# EAGLE design led (EAGLE 9.2.1)

## Sheet 1 of 2
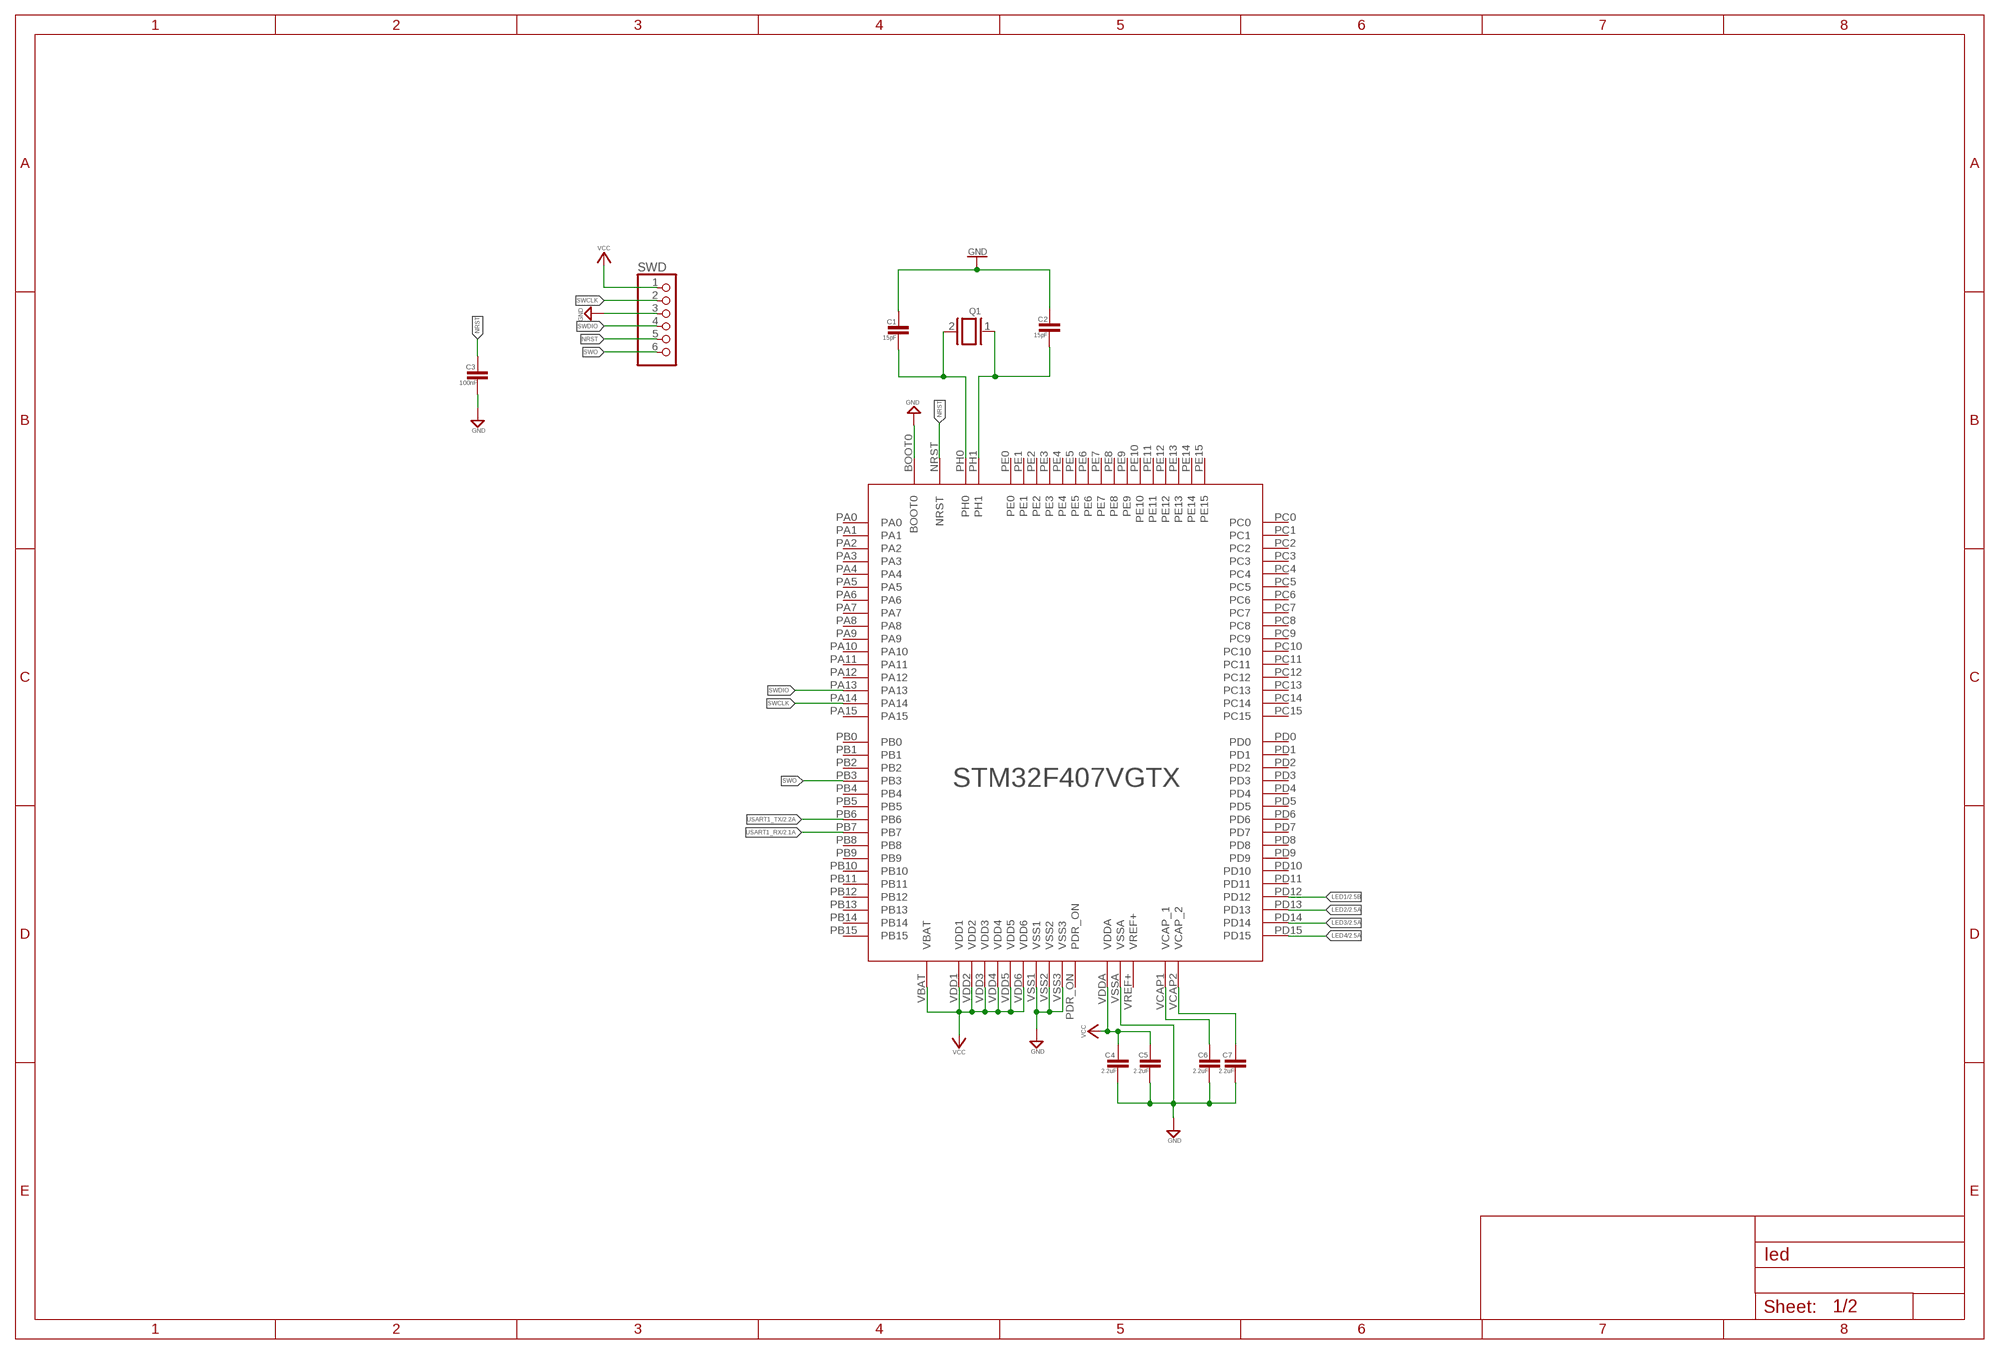
[diagram p0: schematic, sheet 1]

### Parts
C1  15pF  C-EUC0603  [C0603]
C2  15pF  C-EUC0603  [C0603]
C3  100nF  C-EUC0603  [C0603]
C4  2.2uF  C-EUC0603  [C0603]
C5  2.2uF  C-EUC0603  [C0603]
C6  2.2uF  C-EUC0603  [C0603]
C7  2.2uF  C-EUC0603  [C0603]
IC1  STM32F407VGTx  STM32F4V_100PIN_GENERIC  [LQFP100]
Q1  XTAL/S  [QS]
SWD  PINHD-1X6CB  [1X06-CLEANBIG]

### Nets
GND: C1.1 C2.1 C3.2 C4.2 C5.2 C6.2 C7.2 IC1.BOOT0 IC1.VSS1 IC1.VSS2 IC1.VSS3 IC1.VSSA SWD.3 ; also sheet 2
LED1: IC1.PD12 ; also sheet 2
LED2: IC1.PD13 ; also sheet 2
LED3: IC1.PD14 ; also sheet 2
LED4: IC1.PD15 ; also sheet 2
N$1: C2.2 IC1.PH1 Q1.1
N$2: C1.2 IC1.PH0 Q1.2
N$3: C6.1 IC1.VCAP1(VCAP_1)
N$4: C7.1 IC1.VCAP2(VCAP_2)
NRST: C3.1 IC1.NRST SWD.5
SWCLK: IC1.PA14 SWD.2
SWDIO: IC1.PA13 SWD.4
SWO: IC1.PB3 SWD.6
USART1_RX: IC1.PB7 ; also sheet 2
USART1_TX: IC1.PB6 ; also sheet 2
VCC: C4.1 C5.1 IC1.VBAT IC1.VDD1 IC1.VDD2 IC1.VDD3 IC1.VDD4 IC1.VDD5 IC1.VDD6 IC1.VDDA SWD.1 ; also sheet 2
Unconnected: IC1.PA0 IC1.PA1 IC1.PA2 IC1.PA3 IC1.PA4 IC1.PA5 IC1.PA6 IC1.PA7 IC1.PA8 IC1.PA9 IC1.PA10 IC1.PA11 IC1.PA12 IC1.PA15 IC1.PB0 IC1.PB1 IC1.PB2 IC1.PB4 IC1.PB5 IC1.PB8 IC1.PB9 IC1.PB10 IC1.PB11 IC1.PB12 IC1.PB13 IC1.PB14 IC1.PB15 IC1.PC0 IC1.PC1 IC1.PC2 IC1.PC3 IC1.PC4 IC1.PC5 IC1.PC6 IC1.PC7 IC1.PC8 IC1.PC9 IC1.PC10 IC1.PC11 IC1.PC12 IC1.PC13 IC1.PC14 IC1.PC15 IC1.PD0 IC1.PD1 IC1.PD2 IC1.PD3 IC1.PD4 IC1.PD5 IC1.PD6 IC1.PD7 IC1.PD8 IC1.PD9 IC1.PD10 IC1.PD11 IC1.PDR_ON IC1.PE0 IC1.PE1 IC1.PE2 IC1.PE3 IC1.PE4 IC1.PE5 IC1.PE6 IC1.PE7 IC1.PE8 IC1.PE9 IC1.PE10 IC1.PE11 IC1.PE12 IC1.PE13 IC1.PE14 IC1.PE15 IC1.VREF+

## Sheet 2 of 2
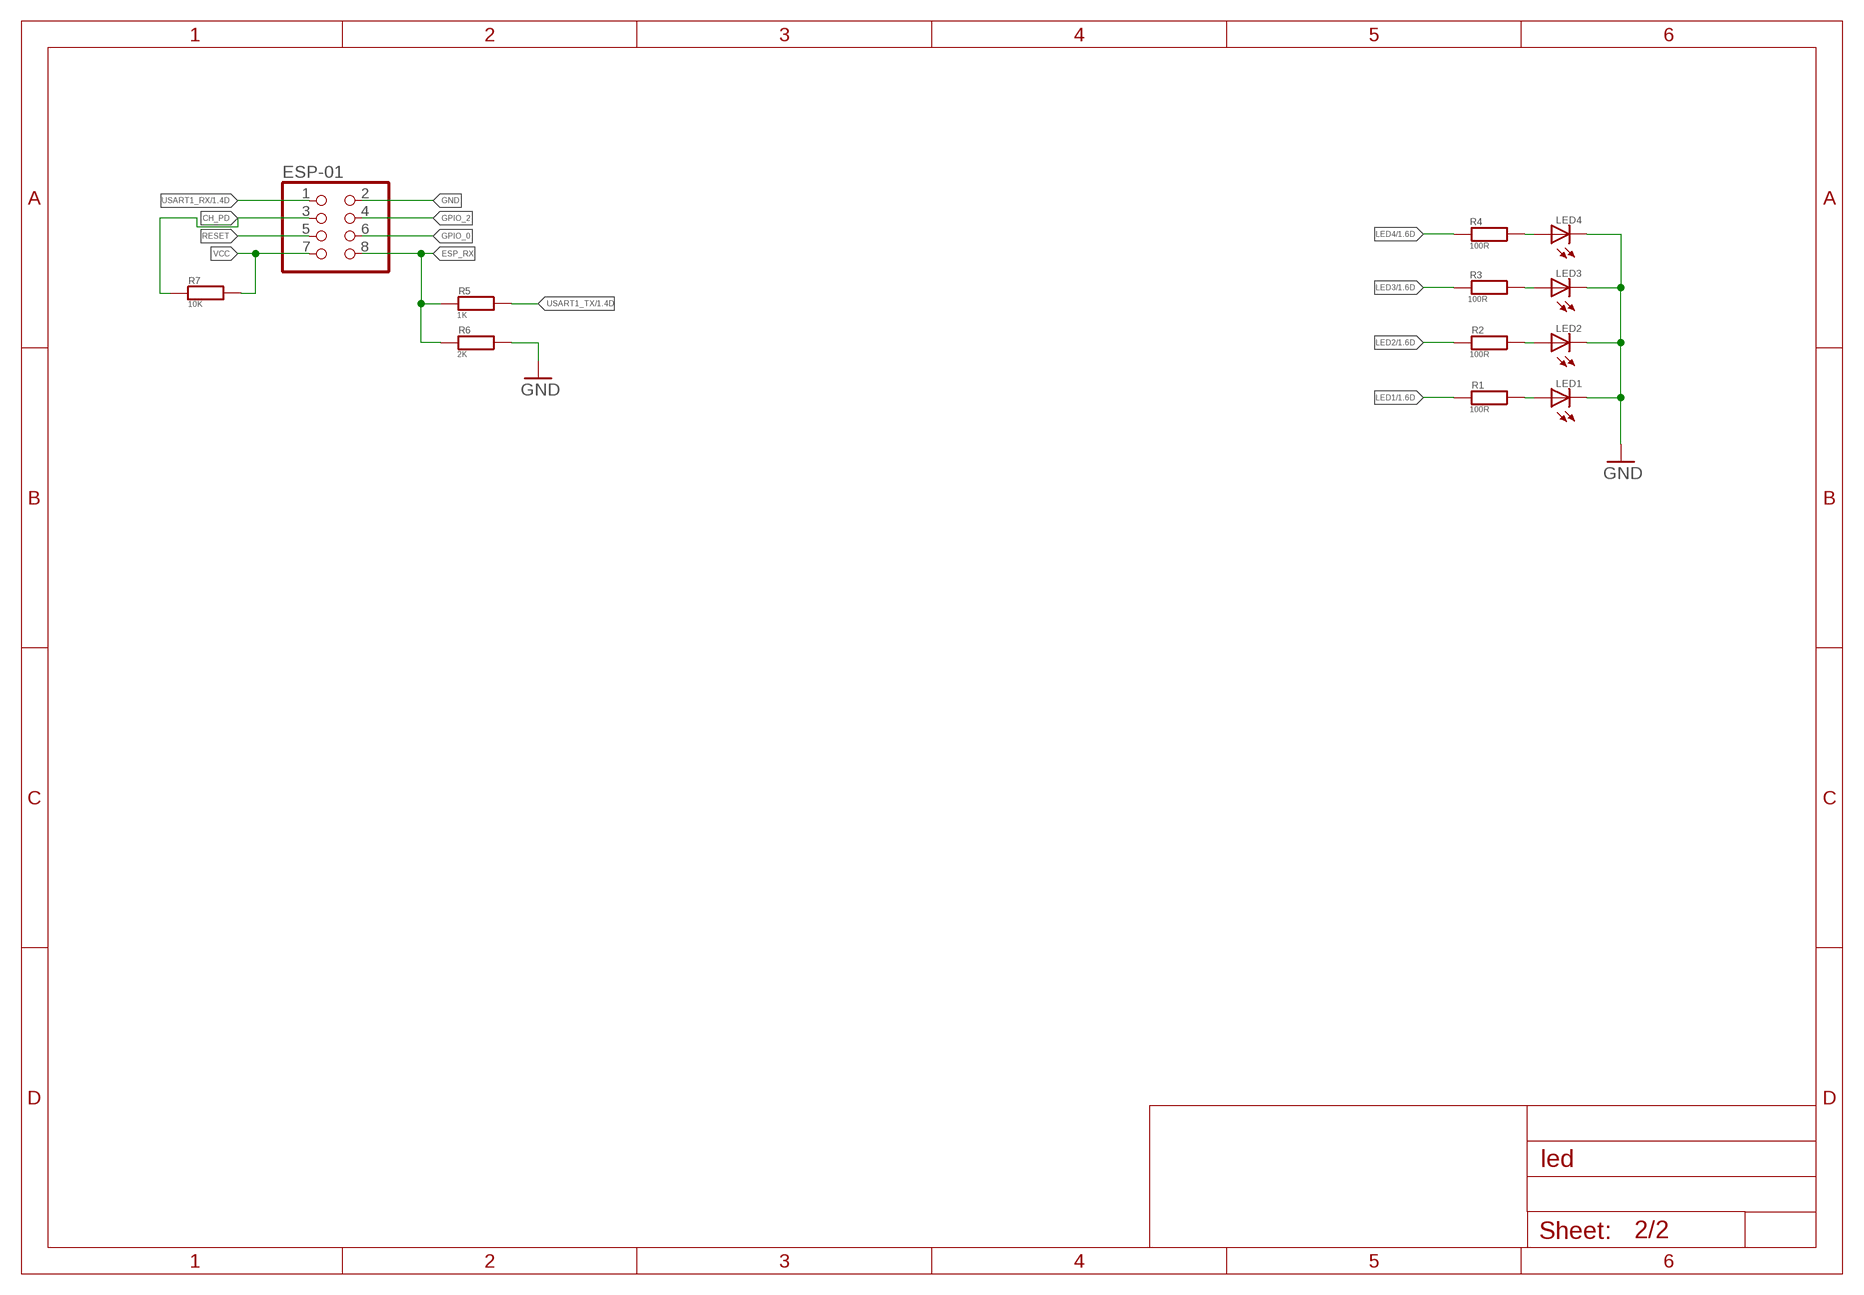
[diagram p1: schematic, sheet 2]

### Parts
ESP-01  PINHD-2X4  [2X04]
LED1  LEDCHIPLED_1206  [CHIPLED_1206]
LED2  LEDCHIPLED_1206  [CHIPLED_1206]
LED3  LEDCHIPLED_1206  [CHIPLED_1206]
LED4  LEDCHIPLED_1206  [CHIPLED_1206]
R1  100R  R-EU_R0603  [R0603]
R2  100R  R-EU_R0603  [R0603]
R3  100R  R-EU_R0603  [R0603]
R4  100R  R-EU_R0603  [R0603]
R5  1K  R-EU_R0603  [R0603]
R6  2K  R-EU_R0603  [R0603]
R7  10K  R-EU_R0603  [R0603]

### Nets
CH_PD: ESP-01.3 R7.1
ESP_RX: ESP-01.8 R5.2 R6.2
GND: ESP-01.2 LED1.C LED2.C LED3.C LED4.C R6.1 ; also sheet 1
GPIO_0: ESP-01.6
GPIO_2: ESP-01.4
LED1: R1.2 ; also sheet 1
LED2: R2.2 ; also sheet 1
LED3: R3.2 ; also sheet 1
LED4: R4.2 ; also sheet 1
N$5: LED1.A R1.1
N$6: LED2.A R2.1
N$7: LED3.A R3.1
N$9: LED4.A R4.1
RESET: ESP-01.5
USART1_RX: ESP-01.1 ; also sheet 1
USART1_TX: R5.1 ; also sheet 1
VCC: ESP-01.7 R7.2 ; also sheet 1

## Library data of the parts
C1-C7 = rcl:C-EU: CAPACITOR, European symbol; SPICEPREFIX: C
ESP-01 = adafruit:PINHD-2X4: PIN HEADER
IC1 = stm32f4:STM32F4V_100PIN_GENERIC; STM32F407VGTX: STM32F407VGTx
LED1-LED4 = led:LED: LED OSRAM: - CHIPLED LG R971, LG N971, LY N971, LG Q971, LY Q971, LO R971, LY R971 LH N974, LH R974 LS Q976, LO Q976, LY Q976 LO Q996 - Hyper CHIPLED LW Q18S LB Q993, LB Q99A, LB R99A - SideLED LS A670, LO A670, LY A670, LG A670, LP A670 LB A673, LV A673, LT A673, LW A673 LH A674 LY A675 LS A676, LA A676, LO A676, LY A676, LW A676 LS A679, LY A679, LG A679 - Hyper Micro SIDELED® LS Y876, LA Y876, LO Y876, LY Y876 LT Y87S - SmartLED LW L88C, LW L88S LB L89C, LB L89S, LG L890 LS L89K, LO L89K, LY L89K LS L896, LA L896, LO L896, LY L896 - TOPLED LS T670, LO T670, LY T670, LG T670, LP T670 LSG T670, LSP T670, LSY T670, LOP T670, LYG T670 LG T671, LOG T671, LSG T671 LB T673, LV T673, LT T673, LW T673 LH T674 LS T676, LA T676, LO T676, LY T676, LB T676, LH T676, LSB T676, LW T676 LB T67C, LV T67C, LT T67C, LS T67K, LO T67K, LY T67K, LW E67C LS E67B, LA E67B, LO E67B, LY E67B, LB E67C, LV E67C, LT E67C LW T67C LS T679, LY T679, LG T679 LS T770, LO T770, LY T770, LG T770, LP T770 LB T773, LV T773, LT T773, LW T773 LH T774 LS E675, LA E675, LY E675, LS T675 LS T776, LA T776, LO T776, LY T776, LB T776 LHGB T686 LT T68C, LB T68C - Hyper Mini TOPLED® LB M676 - Mini TOPLED Santana® LG M470 LS M47K, LO M47K, LY M47K Source: http://www.osram.convergy.de LUXEON: - LUMILED® LXK2-PW12-R00, LXK2-PW12-S00, LXK2-PW14-U00, LXK2-PW14-V00 LXK2-PM12-R00, LXK2-PM12-S00, LXK2-PM14-U00 LXK2-PE12-Q00, LXK2-PE12-R00, LXK2-PE12-S00, LXK2-PE14-T00, LXK2-PE14-U00 LXK2-PB12-K00, LXK2-PB12-L00, LXK2-PB12-M00, LXK2-PB14-N00, LXK2-PB14-P00, LXK2-PB14-Q00 LXK2-PR12-L00, LXK2-PR12-M00, LXK2-PR14-Q00, LXK2-PR14-R00 LXK2-PD12-Q00, LXK2-PD12-R00, LXK2-PD12-S00 LXK2-PH12-R00, LXK2-PH12-S00 LXK2-PL12-P00, LXK2-PL12-Q00, LXK2-PL12-R00 Source: www.luxeon.com KINGBRIGHT: KA-3528ASYC Source: www.kingbright.com
Q1 = special:XTAL/S: CRYSTAL
R1-R7 = rcl:R-EU_: RESISTOR, European symbol; SPICEPREFIX: R
SWD = adafruit:PINHD-1X6: PIN HEADER

## Board
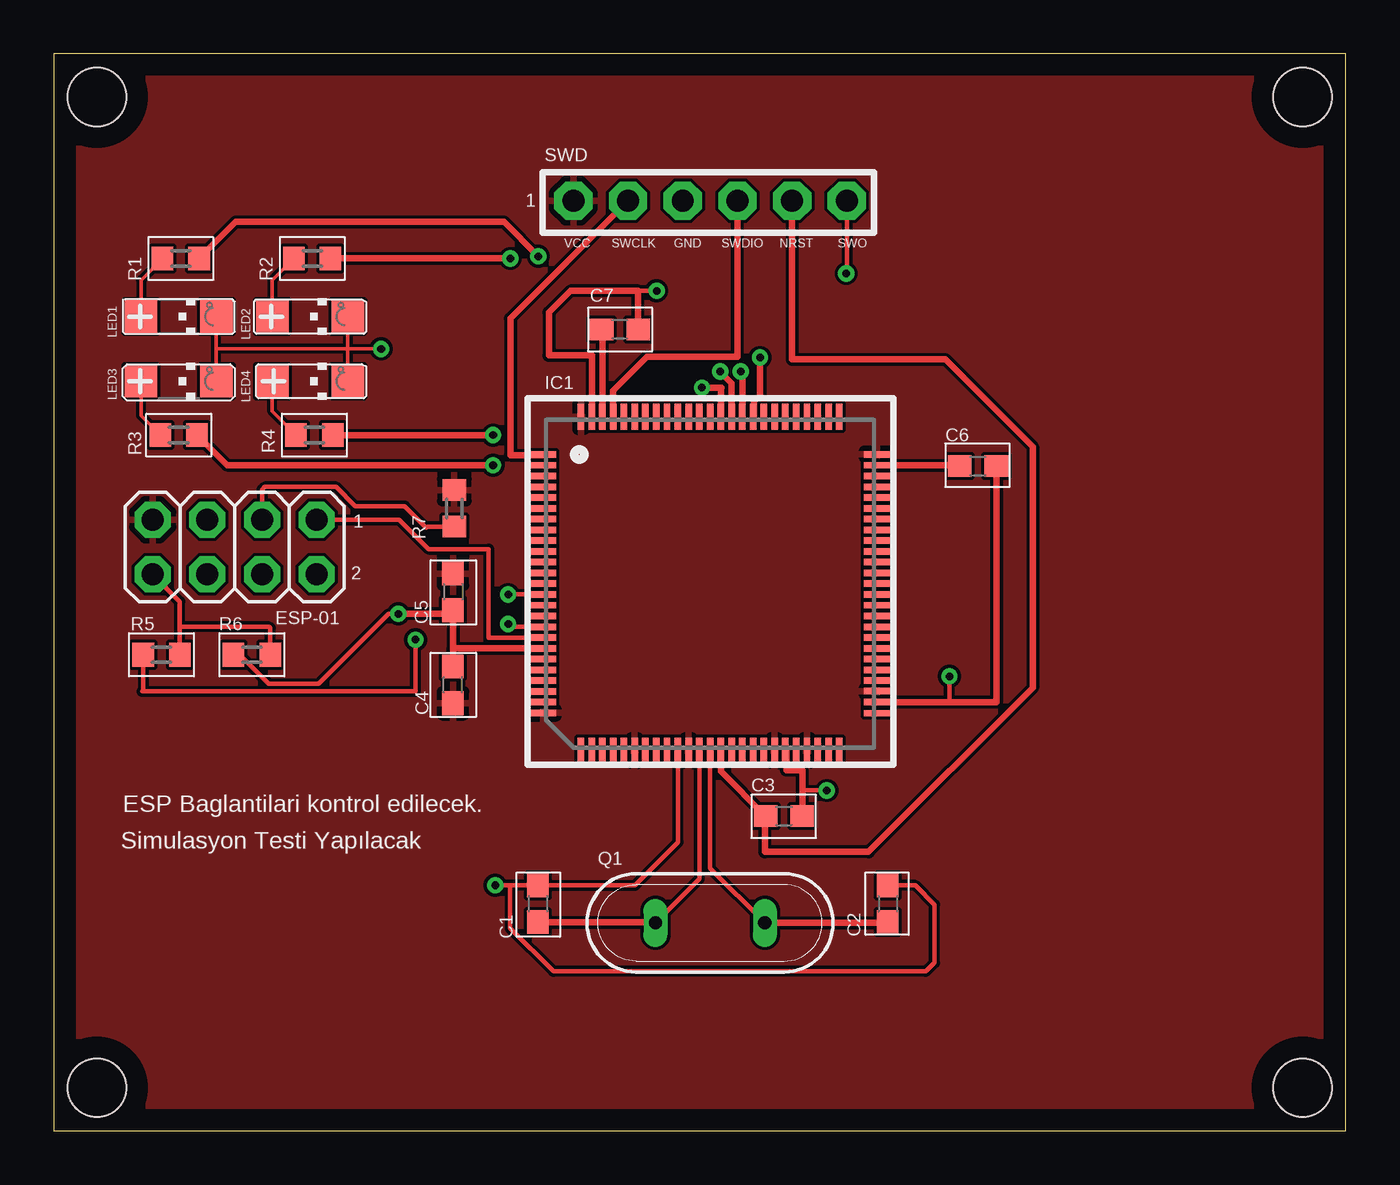
[diagram p2: board, top side]
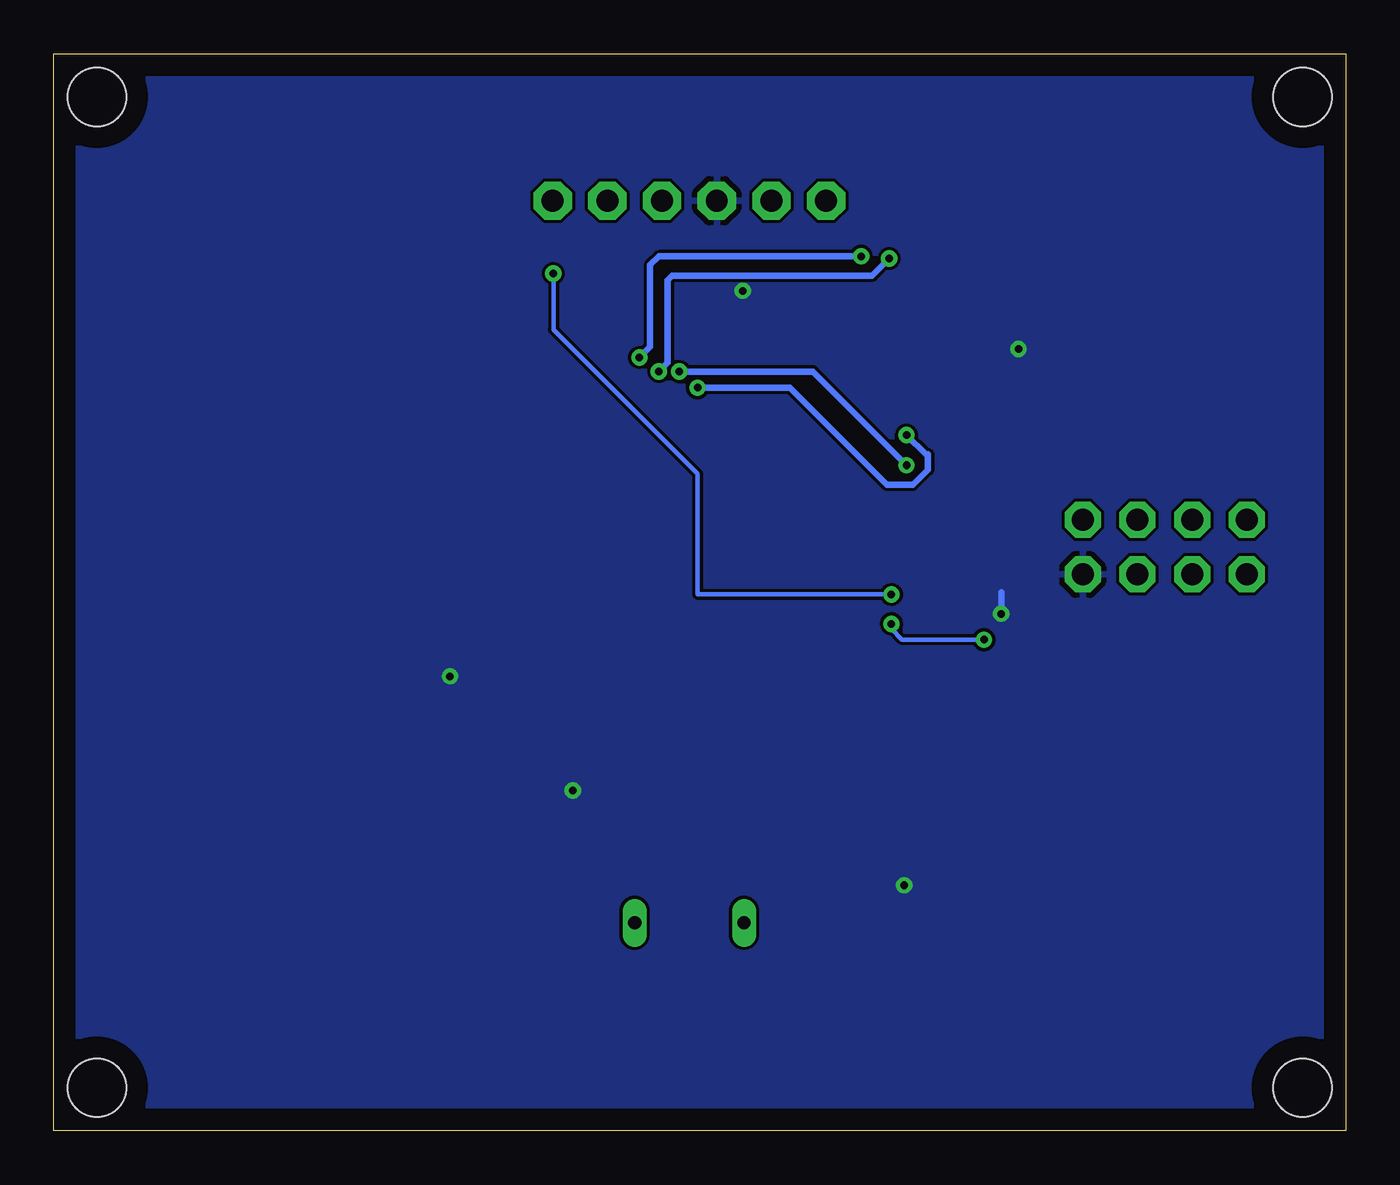
[diagram p3: board, bottom side, seen from below]

Size 60 x 50 mm. Coordinates in mm from the lower left corner, seen from the top.
Outline: 0,0 60,0 60,50 0,50 0,0
Copper layers (1*16): Top 0.035mm / dielectric 1.5mm / Bottom 0.035mm
Design rules "default": minimum track width 6mil, minimum drill 0.35mm, track to track 6mil, track to pad 6mil, pad to pad 6mil, via to via 6mil, smd to smd 6mil, copper to edge 40mil, drill to drill 6mil, minimum pad ring 10mil, minimum via ring 8mil, stop-mask expansion 4mil, vias tented up to drill 0mil, thermal gap 10mil
Holes 2.7 mm at 2,48 58,48 2,2 58,2

### Footprints (pad centres in the part's own frame; a part is rotated, then mirrored left to right if it is on the bottom)
C0603 = smd 1.1 x 1: 1 -0.85,0; 2 0.85,0
2X04 = drill 1.016 pad 1.676 octagon: 1 -3.81,-1.27; 2 -3.81,1.27; 3 -1.27,-1.27; 4 -1.27,1.27; 5 1.27,-1.27; 6 1.27,1.27; 7 3.81,-1.27; 8 3.81,1.27
LQFP100 = smd 1.2 x 0.3: BOOT0 -7.75,-3; PA3 7.75,-6.016; PA4 7.75,-4.5; PA5 7.75,-4; PA6 7.75,-3.5; PA7 7.75,-3; PA14 -7.75,6; PA15 -7.75,5.5; PB0 7.75,-1.5; PB1 7.75,-1; PB2 7.75,-0.5; PB3 -7.75,-0.5; PB4 -7.75,-1; PB5 -7.75,-1.5; PB6 -7.75,-2; PB7 -7.75,-2.5; PB8 -7.75,-3.5; PB9 -7.75,-4; PB10 7.75,4.5; PB11 7.75,5; PC4 7.75,-2.5; PC5 7.75,-2; PC10 -7.75,5; PC11 -7.75,4.5; PC12 -7.75,4; PD0 -7.75,3.5; PD1 -7.75,3; PD2 -7.75,2.5; PD3 -7.75,2; PD4 -7.75,1.5; PD5 -7.75,1; PD6 -7.75,0.5; PD7 -7.75,0; PDR_ON -7.75,-5.5; PE0 -7.75,-4.5; PE1 -7.75,-5; PE7 7.75,0; PE8 7.75,0.5; PE9 7.75,1; PE10 7.75,1.5; PE11 7.75,2; PE12 7.75,2.5; PE13 7.75,3; PE14 7.75,3.5; PE15 7.75,4; VCAP1 7.75,5.5; VDD3 7.75,-4.984; VDD4 7.75,6; VDD6 -7.75,-6; VSS2 7.75,-5.5 | smd 0.3 x 1.2: NRST 0.5,-7.75; PA0 5,-7.75; PA1 5.5,-7.75; PA2 6,-7.75; PA8 -2,7.75; PA9 -2.5,7.75; PA10 -3,7.75; PA11 -3.5,7.75; PA12 -4,7.75; PA13 -4.5,7.75; PB12 6,7.75; PB13 5.5,7.75; PB14 5,7.75; PB15 4.5,7.75; PC0 1,-7.75; PC1 1.5,-7.75; PC2 2,-7.75; PC3 2.5,-7.75; PC6 0,7.75; PC7 -0.5,7.75; PC8 -1,7.75; PC9 -1.5,7.75; PC13 -3,-7.75; PC14 -2.5,-7.75; PC15 -2,-7.75; PD8 4,7.75; PD9 3.5,7.75; PD10 3,7.75; PD11 2.5,7.75; PD12 2,7.75; PD13 1.5,7.75; PD14 1,7.75; PD15 0.5,7.75; PE2 -6,-7.75; PE3 -5.5,-7.75; PE4 -5,-7.75; PE5 -4.5,-7.75; PE6 -4,-7.75; PH0 -0.5,-7.75; PH1 0,-7.75; VBAT -3.5,-7.75; VCAP2 -5,7.75; VDD1 -1,-7.75; VDD2 3,-7.75; VDD5 -6,7.75; VDDA 4.5,-7.75; VREF+ 4,-7.75; VSS1 -1.5,-7.75; VSS3 -5.5,7.75; VSSA 3.5,-7.75
CHIPLED_1206 = smd 1.5 x 1.5: A 0,-1.75; C 0,1.75
QS = drill 0.61 long: 1 -2.54,0; 2 2.54,0
R0603 = smd 1 x 1.1: 1 -0.85,0; 2 0.85,0
1X06-CLEANBIG = drill 1.016 pad 1.778 octagon: 1 -6.35,0; 2 -3.81,0; 3 -1.27,0; 4 1.27,0; 5 3.81,0; 6 6.35,0

### Placement (x,y rotation side)
C1  22.48,10.54 270 top
C2  38.73,10.54 270 top
C3  33.91,14.61 0 top
C4  18.54,20.7 90 top
C5  18.54,25.02 270 top
C6  42.93,30.86 0 top
C7  26.29,37.21 0 top
ESP-01  8.4,27.1 180 top
IC1  30.48,25.4 0 top
LED1  5.8,37.8 270 top
LED2  11.9,37.8 270 top
LED3  5.8,34.8 270 top
LED4  11.9,34.8 270 top
Q1  30.48,9.65 180 top
R1  5.9,40.5 0 top
R2  12,40.5 0 top
R3  5.8,32.3 0 top
R4  12.1,32.3 0 top
R5  5,22.1 0 top
R6  9.2,22.1 0 top
R7  18.6,28.9 90 top
SWD  30.48,43.18 0 top

### Tracks (layer width: path | path; a pad name or v marks a point on that pad's centre or on a via)
CH_PD
  Top 0.203: R7.1 17.35,28.05 17.3,28 16.3,29 14,29 13.1,29.9 9.8,29.9 9.67,29.77 ESP-01.3
ESP_RX
  Top 0.203: R5.2 5.85,23.4 | 5.85,23.4 5.85,24.57 ESP-01.8 | R6.2 10.05,23.35 10,23.4 5.85,23.4
GND  (via drill 0.35)
  Top 0.152: LED3.C 7.55,36.3 | 7.55,36.3 LED1.C | LED2.C 13.65,36.3 | 13.65,36.3 LED4.C | 13.65,36.3 7.55,36.3 | 13.65,36.3 v15.2,36.3
  Top 0.203: R6.1 8.64,22.1 9.98,20.76 12.3,20.76 15.54,24 v16,24 | 41.6,19.9 v41.6,21.1 | 34.76,15.8 v35.9,15.8 | 21.2,11.39 C1.1 26.99,11.39 29,13.4 28.98,13.42 IC1.VSS1 | 21.2,11.39 v20.51,11.39 v20.5,11.4 | 21.2,11.39 21.2,9.4 23.2,7.4 40.5,7.4 40.9,7.8 40.9,10.5 40.01,11.39 C2.1 | 27.14,39 v28,39
  Top 0.305: IC1.BOOT0 18.54,22.4 C4.2 C5.2 18.54,24 v16,24 | C6.2 43.78,19.9 41.6,19.9 IC1.VSS2 | C3.2 34.76,15.8 34.76,16.75 34.02,16.75 34.02,17.65 IC1.VSSA | C7.2 27.14,39 24,39 23,38 23,36 25,36 25,33.15 IC1.VSS3
  Bottom 0.305: v16,24 16,25
  pour Bottom: -0.64,50.55 61.98,50.55 61.98,0.25 59.31,-2.41 -0.76,-2.41 -1.65,-1.52 -2.54,-0.64 -2.54,50.42 -0.76,50.42
LED1  (via drill 0.35)
  Top 0.305: R1.2 8.45,42.2 20.9,42.2 v22.5,40.6 | IC1.PD12 32.52,33.2 32.52,33.88 32.8,34.15 v32.8,35.9
  Bottom 0.305: v22.5,40.6 31.9,40.6 32.3,40.2 32.3,36.4 v32.8,35.9
LED2  (via drill 0.35)
  Top 0.305: R2.2 v21.2,40.5 | v31.9,35.26 31.98,35.18 IC1.PD13
  Bottom 0.305: v21.2,40.5 22,39.7 31.3,39.7 31.5,39.5 31.5,35.66 v31.9,35.26
LED3  (via drill 0.35)
  Top 0.305: R3.2 8.05,30.9 v20.4,30.9 | v30.95,35.25 31.48,34.71 IC1.PD14
  Bottom 0.305: v20.4,30.9 24.75,35.25 v30.95,35.25
LED4  (via drill 0.35)
  Top 0.305: R4.2 v20.4,32.3 | v30.1,34.5 31,34.5 30.98,34.48 IC1.PD15
  Bottom 0.305: v20.4,32.3 19.5,31.4 19.4,31.4 19.4,30.7 20.1,30 21.3,30 25.8,34.5 v30.1,34.5
N$1
  Top 0.203: IC1.PH1 30.48,12.19 Q1.1
  Top 0.305: Q1.1 38.7,9.65 C2.2
N$2
  Top 0.203: Q1.2 29.98,11.69 IC1.PH0
  Top 0.305: C1.2 27.9,9.69 Q1.2
N$3
  Top 0.305: IC1.VCAP1 42.04,30.9 C6.1
N$4
  Top 0.305: IC1.VCAP2 25.48,37.17 C7.1
N$5
  Top 0.152: R1.1 4.05,39.5 LED1.A
N$6
  Top 0.152: R2.1 10.15,39.5 LED2.A
N$7
  Top 0.152: R3.1 4.05,33.2 LED3.A
N$9
  Top 0.152: R4.1 10.15,33.4 LED4.A
NRST
  Top 0.305: IC1.NRST 30.98,16.68 C3.1 33.02,14.57 33.02,12.95 37.85,12.95 45.47,20.57 45.47,31.75 41.4,35.81 34.29,35.81 SWD.5
SWCLK
  Top 0.305: SWD.2 25.89,42.41 21.21,37.72 21.21,31.37 22.7,31.37 IC1.PA14
SWDIO
  Top 0.305: IC1.PA13 25.98,34.36 27.56,35.94 31.75,35.94 SWD.4
SWO  (via drill 0.35)
  Top 0.203: SWD.6 36.83,39.83 v36.8,39.8 | v21.1,24.9 IC1.PB3
  Bottom 0.203: v36.8,39.8 36.8,37.2 30.1,30.5 30.1,24.9 v21.1,24.9
USART1_RX
  Top 0.203: ESP-01.1 16.03,28.37 17.4,27 20.2,27 20.2,22.9 IC1.PB7
USART1_TX  (via drill 0.35)
  Top 0.203: R5.1 4.15,20.45 4.1,20.4 16.8,20.4 v16.8,22.8 | v21.1,23.53 21.23,23.4 IC1.PB6
  Bottom 0.203: v16.8,22.8 20.6,22.8 21.1,23.3 v21.1,23.53
VCC
  pour Top: -0.76,51.82 61.09,51.82 61.34,51.56 61.34,-1.02 61.98,-1.65 -2.16,-1.65 -2.67,-1.14

### Text on the board
tNames: 1 | VCC | SWCLK | GND | SWDIO | NRST | SWO | 1 | 2 | ESP Baglantilari kontrol edilecek. | Simulasyon Testi Yapılacak